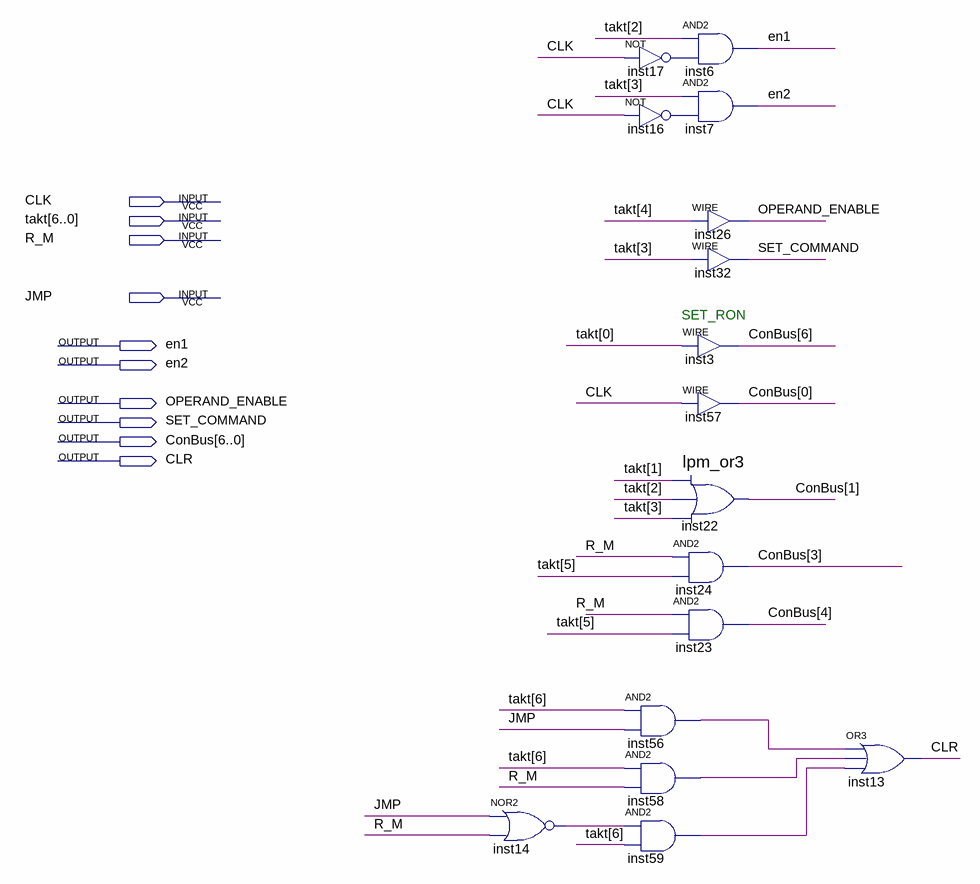
[diagram p0: schematic sheet]
// Quartus schematic COMMAND_GENERATOR.bdf as structural Verilog: 16 symbols, 10 pins
module COMMAND_GENERATOR (
  input  CLK,
  input  [6:0] takt,
  input  R_M,
  input  JMP,
  output en1,
  output en2,
  output OPERAND_ENABLE,
  output SET_COMMAND,
  output [6:0] ConBus,
  output CLR
);

  wire inst14_out, inst16_out, inst17_out, inst56_out, inst58_out, inst59_out;

  nor inst14 (inst14_out, JMP, R_M);
  not inst17 (inst17_out, CLK);
  not inst16 (inst16_out, CLK);
  and inst56 (inst56_out, takt[6], JMP);
  and inst58 (inst58_out, takt[6], R_M);
  and inst59 (inst59_out, inst14_out, takt[6]);
  and inst6 (en1, takt[2], inst17_out);
  and inst7 (en2, takt[3], inst16_out);
  assign OPERAND_ENABLE = takt[4];  // WIRE inst26
  assign SET_COMMAND = takt[3];  // WIRE inst32
  assign ConBus[6] = takt[0];  // WIRE inst3
  assign ConBus[0] = CLK;  // WIRE inst57
  lpm_or3 inst22 (.data0(takt[1]), .data1(takt[2]), .data2(takt[3]), .result(ConBus[1]));
  and inst24 (ConBus[3], R_M, takt[5]);
  and inst23 (ConBus[4], R_M, takt[5]);
  or inst13 (CLR, inst56_out, inst58_out, inst59_out);

  // Notes on the sheet:
  //   SET_RON
endmodule
